# EAGLE schematic ver2.0 (EAGLE 6.1)
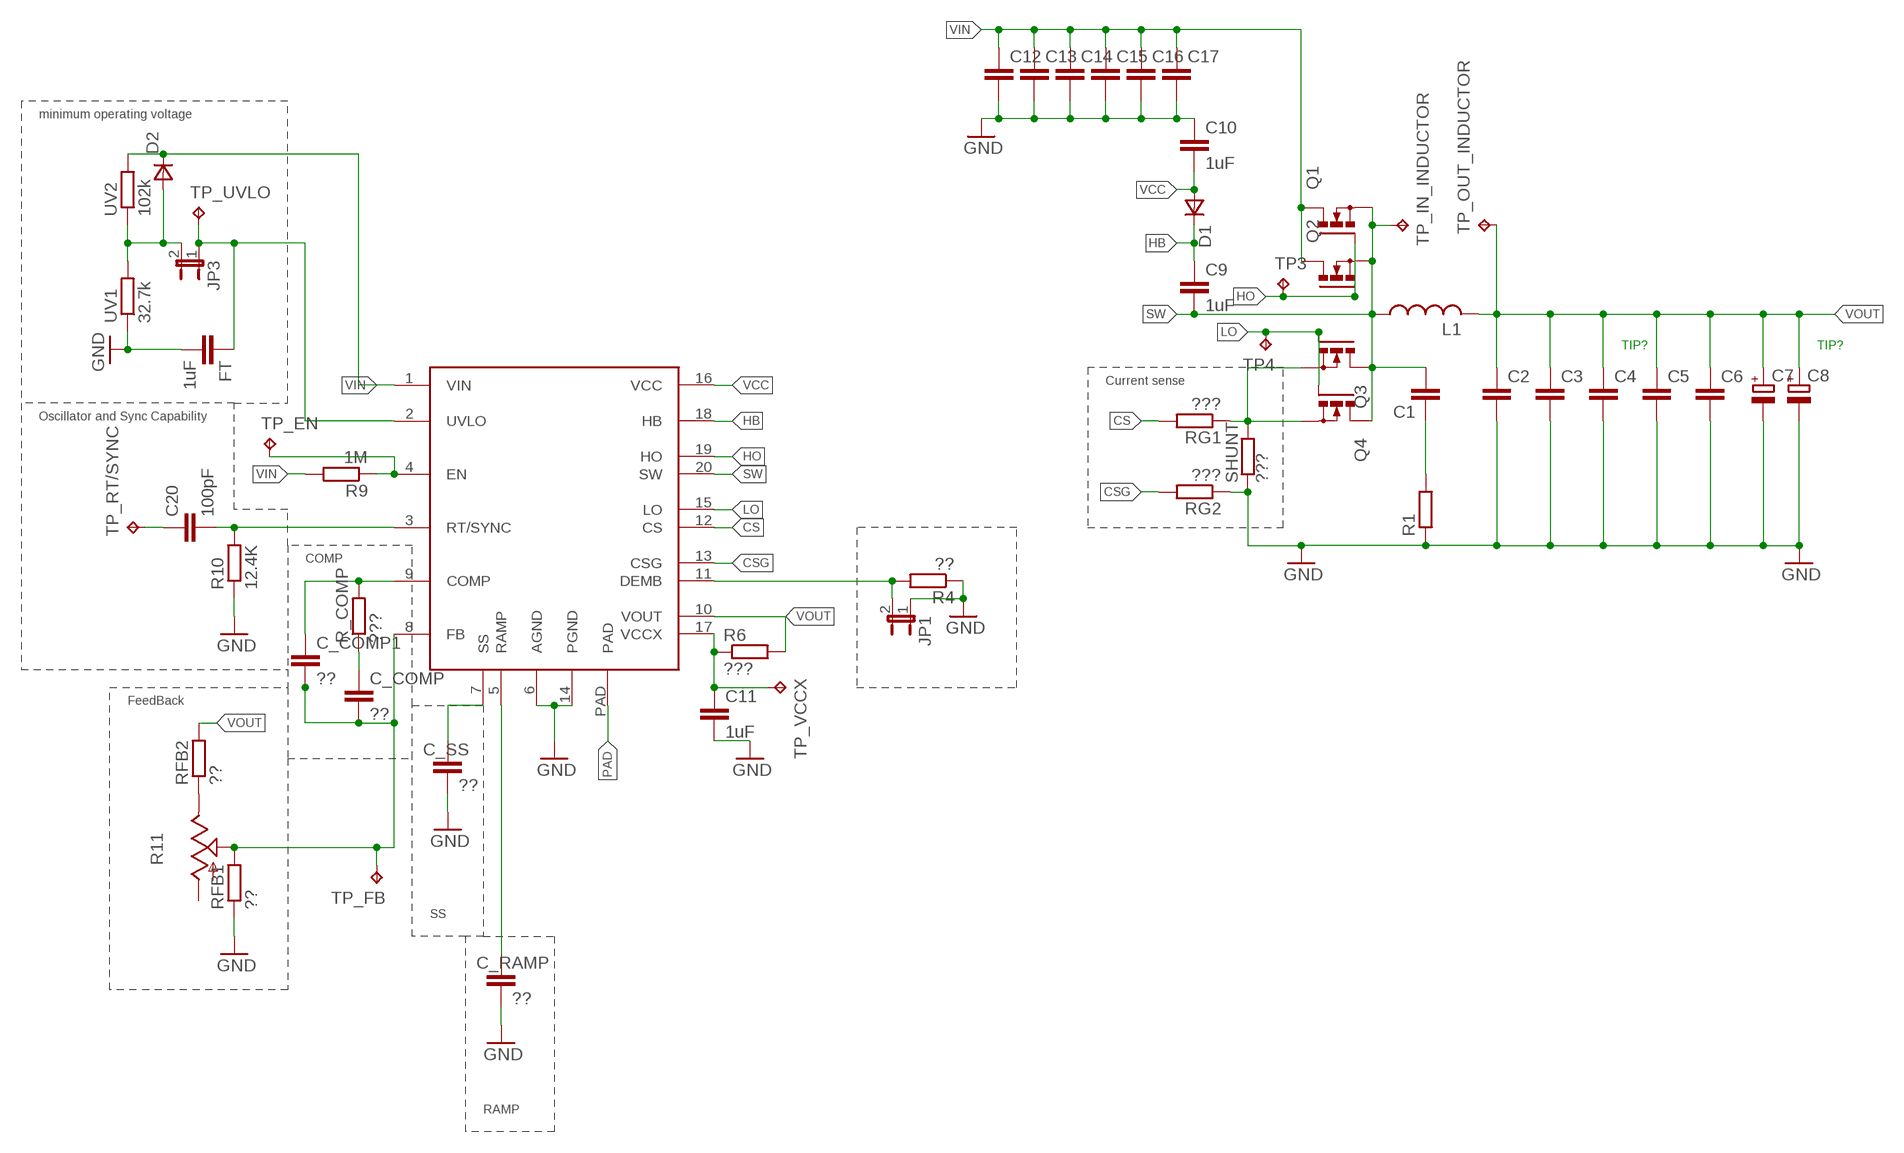
[diagram p0: schematic, sheet 1]

## Parts
C1  C-EUC0805K  [C0805K]
C2  C-EUC1812  [C1812]
C3  C-EUC1812  [C1812]
C4  C-EUC1812  [C1812]
C5  C-EUC1812  [C1812]
C6  C-EUC1812  [C1812]
C7  CPOL-EU153CLV-1012  [153CLV-1012]
C8  CPOL-EU153CLV-1012  [153CLV-1012]
C9  1uF  C-EUC0805K  [C0805K]
C10  1uF  C-EUC0805K  [C0805K]
C11  1uF  C-EUC0805K  [C0805K]
C12  C-EUC1812K  [C1812K]
C13  C-EUC1812K  [C1812K]
C14  C-EUC1812K  [C1812K]
C15  C-EUC1812K  [C1812K]
C16  C-EUC1812K  [C1812K]
C17  C-EUC1812K  [C1812K]
C20  100pF  C-EUC0805K  [C0805K]
C_COMP  ??  C-EUC0805K  [C0805K]
C_COMP1  ??  C-EUC0805K  [C0805K]
C_RAMP  ??  C-EUC0805K  [C0805K]
C_SS  ??  C-EUC0805K  [C0805K]
D1  DSOT23  [SOT-23]
D2  DSOT23  [SOT-23]
FT  1uF  C-EUC1812K  [C1812K]
JP1  JP1E  [JP1]
JP3  JP1E  [JP1]
L1  L-USTJ8-U2  [TJ8-U2]
Q1  PMOSFET_NTO220BH  [TO220BH]
Q2  PMOSFET_NTO220BH  [TO220BH]
Q3  PMOSFET_NTO220BH  [TO220BH]
Q4  PMOSFET_NTO220BH  [TO220BH]
R1  R-EU_M1206  [M1206]
R4  ??  R-EU_R0603  [R0603]
R6  ???  R-EU_R0603  [R0603]
R9  1M  R-EU_R0603  [R0603]
R10  12.4K  R-EU_R0603  [R0603]
R11  TRIM_US-B64Y  [B64Y]
R_COMP  ???  R-EU_R0603  [R0603]
RFB1  ??  R-EU_R0603  [R0603]
RFB2  ??  R-EU_R0603  [R0603]
RG1  ???  R-EU_R0603  [R0603]
RG2  ???  R-EU_R0603  [R0603]
SHUNT  ???  SMR-0  [SMR-0]
TP3  TPPAD1-20  [P1-20]
TP4  TPPAD1-20  [P1-20]
TP_EN  TPPAD1-20  [P1-20]
TP_FB  TPPAD1-20  [P1-20]
TP_IN_INDUCTOR  TPPAD1-20  [P1-20]
TP_OUT_INDUCTOR  TPPAD1-20  [P1-20]
TP_RT/SYNC  TPPAD1-20  [P1-20]
TP_UVLO  TPPAD1-20  [P1-20]
TP_VCCX  TPPAD1-20  [P1-20]
U$1  LM5116  [TSSOP20]
UV1  32.7k  R-EU_R0603  [R0603]
UV2  102k  R-EU_R0603  [R0603]

## Nets
CS: RG1.2 U$1.12(CS)
CSG: RG2.2 U$1.13(CSG)
DEMB: JP1.2 R4.2 U$1.11(DEMB)
GND: C2.2 C3.2 C4.2 C5.2 C6.2 C7.- C8.- C10.1 C11.2 C12.2 C13.2 C14.2 C15.2 C16.2 C17.2 C_RAMP.2 C_SS.2 FT.2 JP1.1 R1.1 R4.1 R10.1 RFB1.1 RG2.1 SHUNT.2 U$1.6(AGND) U$1.14(PGND) UV1.1
HB: C9.1 D1.1(C) U$1.18(HB)
HO: Q1.G Q2.G TP3.TP U$1.19(HO)
LO: Q3.G Q4.G TP4.TP U$1.15(LO)
N$1: C11.1 R6.1 TP_VCCX.TP U$1.17(VCCX)
N$2: C1.1 R1.2
N$3: Q3.S Q4.S RG1.1 SHUNT.1
N$4: R9.1 TP_EN.TP U$1.4(EN)
N$5: C20.2 R10.2 U$1.3(RT/SYNC)
N$6: C_COMP1.2 C_COMP.2 R11.S RFB1.2 TP_FB.TP U$1.8(FB)
N$7: C20.1 TP_RT/SYNC.TP
N$8: R11.E RFB2.1
N$9: C_COMP1.1 R_COMP.2 U$1.9(COMP)
N$10: C_COMP.1 R_COMP.1
N$11: C_SS.1 U$1.7(SS)
N$12: C_RAMP.1 U$1.5(RAMP)
N$14: FT.1 JP3.1 TP_UVLO.TP U$1.2(UVLO)
PAD: U$1.PAD
SW: C1.2 C9.2 L1.1 Q1.S Q2.S Q3.D Q4.D TP_IN_INDUCTOR.TP U$1.20(SW)
UVLO: D2.3(A) JP3.2 UV1.2 UV2.1
VCC: C10.2 D1.3(A) U$1.16(VCC)
VIN: C12.1 C13.1 C14.1 C15.1 C16.1 C17.1 D2.1(C) Q1.D Q2.D R9.2 U$1.1(VIN) UV2.2
VOUT: C2.1 C3.1 C4.1 C5.1 C6.1 C7.+ C8.+ L1.2 R6.2 RFB2.2 TP_OUT_INDUCTOR.TP U$1.10(VOUT)
Unconnected: R11.A

## Notes on the sheet
- minimum operating voltage
- TIP? | TIP?
- Current sense
- Oscillator and Sync Capability
- COMP
- FeedBack
- SS
- RAMP

## Library data of the parts
C1 C9-C11 C20 C_COMP C_COMP1 C_RAMP C_SS = resistor:C-EU: CAPACITOR, European symbol
C2-C6 C12-C17 FT = rcl:C-EU: CAPACITOR, European symbol
C7 C8 = resistor:CPOL-EU: POLARIZED CAPACITOR, European symbol
D1 D2 = zetex:D: DIODE; MPN: CDSOT23-T03; OC_FARNELL: 1824866; OC_NEWARK: 75K7096
JP1 JP3 = jumper:JP1E: JUMPER
L1 = rcl:L-US: INDUCTOR, American symbol
Q1-Q4 = transistor-power:PMOSFET_N: Power MOSFET N-Channel
R1 = resistor:R-EU_: RESISTOR, European symbol
R4 R6 R9 R10 R_COMP RFB1 RFB2 RG1 RG2 UV1 UV2 = rcl:R-EU_: RESISTOR, European symbol
R11 = pot:TRIM_US-: POTENTIOMETER
SHUNT = resistor-shunt:SMR-0: SMD SHUNT RESISTOR; OC_FARNELL: unknown; OC_NEWARK: unknown
TP3 TP4 TP_EN TP_FB TP_IN_INDUCTOR TP_OUT_INDUCTOR TP_RT/SYNC TP_UVLO TP_VCCX = testpad:TP: Test pad
U$1 = 48buck_library:LM5116